# EAGLE design FB_BJ_Taster_1.43_2l (EAGLE 5.04)
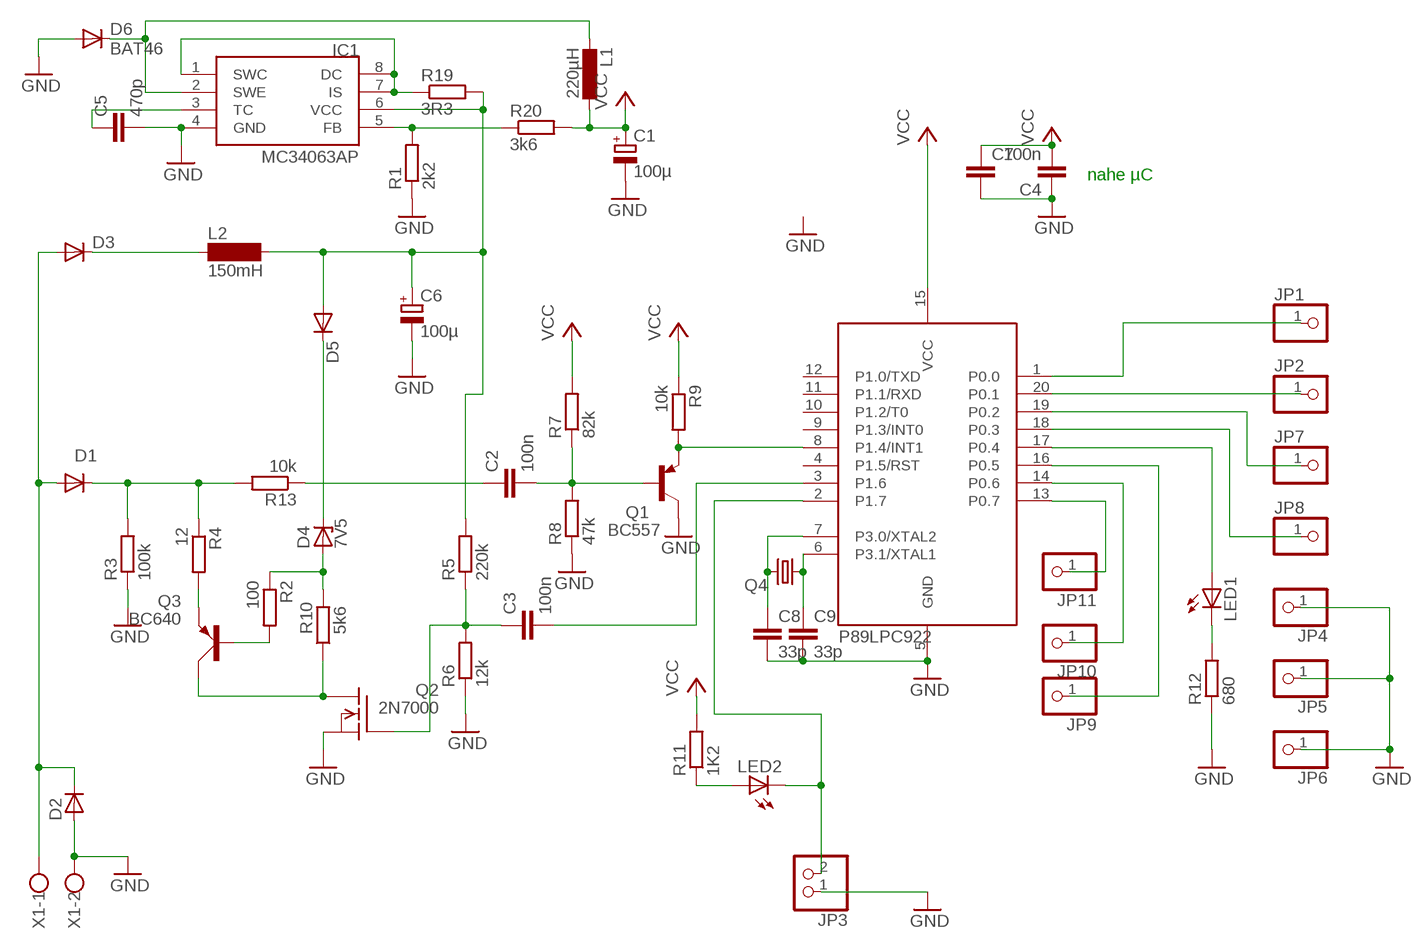
[diagram p0: schematic, sheet 1]

## Parts
C1  100µ  CPOL-EUE5-8.5  [E5-8,5]
C2  100n  C-EU050-024X044  [C050-024X044]
C3  100n  C-EU050-024X044  [C050-024X044]
C4  100n  C-EU050-024X044  [C050-024X044]
C5  470p  C-EU025-024X044  [C025-024X044]
C6  100µ  CPOL-EUE5-8.5  [E5-8,5]
C7  C-EUC1206  [C1206]
C8  33p  C-EUC1206  [C1206]
C9  33p  C-EUC1206  [C1206]
D1  1N4148  [DO35-10]
D2  D-SMB  [SMB]
D3  1N41481N4148S  [D-2.5]
D4  7V5  ZPD  [DO35Z10]
D5  1N4148  [DO35-10]
D6  BAT46  DIODE-D-5  [D-5]
IC1  MC34063AP  [DIL08]
JP1  PINHD-1X1  [1X01]
JP2  PINHD-1X1  [1X01]
JP3  PINHD-1X2  [1X02]
JP4  PINHD-1X1  [1X01]
JP5  PINHD-1X1  [1X01]
JP6  PINHD-1X1  [1X01]
JP7  PINHD-1X1  [1X01]
JP8  PINHD-1X1  [1X01]
JP9  PINHD-1X1  [1X01]
JP10  PINHD-1X1  [1X01]
JP11  PINHD-1X1  [1X01]
L1  220µH  L-EU2200-12.7  [2200-12.7]
L2  150mH  SD12-1000  [SD12_1000]
LED1  LED3MM  [LED3MM]
LED2  LED3MM  [LED3MM]
Q1  BC557  [TO92]
Q2  2N7000  VN2222KM  [TO237]
Q3  BC640  [SOT54D]
Q4  CRYSTALHC49S  [HC49/S]
R1  2k2  R-EU_0207/2V  [0207/2V]
R2  100  R-EU_0207/2V  [0207/2V]
R3  100k  R-EU_0207/2V  [0207/2V]
R4  12  R-EU_0207/2V  [0207/2V]
R5  220k  R-EU_0207/2V  [0207/2V]
R6  12k  R-EU_0207/2V  [0207/2V]
R7  82k  R-EU_0204/7  [0204/7]
R8  47k  R-EU_0204/7  [0204/7]
R9  10k  R-EU_0207/2V  [0207/2V]
R10  5k6  R-EU_0207/2V  [0207/2V]
R11  1K2  R-EU_0207/2V  [0207/2V]
R12  680  R-EU_0204/7  [0204/7]
R13  10k  R-EU_0207/2V  [0207/2V]
R19  3R3  R-EU_0207/2V  [0207/2V]
R20  3k6  R-EU_0207/2V  [0207/2V]
U1  89LPC922  [DIL20]
X1  W237-02P  [W237-132]

## Nets
GND: C1.- C4.1 C5.2 C6.- C7.2 C8.2 C9.2 D2.2(A) D6.A IC1.4(GND) JP3.1 JP4.1 JP5.1 JP6.1 Q1.3(C) Q2.3(S) R1.1 R3.1 R6.1 R8.1 R12.1 U1.5(GND) X1.2
N$1: Q1.1(E) R9.2 U1.8(P1.4/INT1)
N$2: C2.2 Q1.2(B) R7.1 R8.2
N$3: IC1.5(FB) R1.2 R20.1
N$4: IC1.1(SWC) IC1.7(IS) IC1.8(DC) R19.1
N$5: C3.2 U1.3(P1.6)
N$6: Q2.1(D) Q3.C R10.1
N$7: C6.+ D5.A IC1.6(VCC) L2.2 R5.2 R19.2
N$8: D3.C L2.1
N$9: D1.C R3.2 R4.1 R13.2
N$10: D6.C IC1.2(SWE) L1.2
N$11: D4.A R2.1 R10.2
N$12: Q3.E R4.2
N$13: C5.1 IC1.3(TC)
N$14: Q3.B R2.2
N$15: LED1.A U1.17(P0.4)
N$16: D1.A D2.1(C) D3.A X1.1
N$17: JP3.2 LED2.K(C) U1.2(P1.7)
N$18: LED1.K(C) R12.2
N$19: LED2.A R11.1
N$20: JP7.1 U1.19(P0.2)
N$21: JP1.1 U1.1(P0.0)
N$22: JP2.1 U1.20(P0.1)
N$23: JP8.1 U1.18(P0.3)
N$28: JP9.1 U1.16(P0.5)
N$29: JP11.1 U1.13(P0.7)
N$30: JP10.1 U1.14(P0.6)
N$31: C9.1 Q4.1 U1.6(P3.1/XTAL1)
N$32: C8.1 Q4.2 U1.7(P3.0/XTAL2)
N$33: C2.1 R13.1
N$34: C3.1 Q2.2(G) R5.1 R6.2
N$40: D4.C D5.C
VCC: C1.+ C4.2 C7.1 L1.1 R7.2 R9.1 R11.2 R20.2 U1.15(VCC)
Unconnected: U1.4(P1.5/RST) U1.9(P1.3/INT0) U1.10(P1.2/T0) U1.11(P1.1/RXD) U1.12(P1.0/TXD)

## Notes on the sheet
- nahe µC
- P89LPC922

## Library data of the parts
C1 C6 = rcl:CPOL-EU: POLARIZED CAPACITOR, European symbol
C2-C5 C7-C9 = rcl:C-EU: CAPACITOR, European symbol
D1 D3 D5 = diode:1N4148: DIODE high speed (Philips)
D2 = semicon-smd-ipc:D-: DIODE unfilled
D4 = diode:ZPD: Z DIODE 500 mW
D6 = diode:DIODE-: DIODE
IC1 = mc34063:MC34063
JP1 JP2 JP4-JP11 = pinhead:PINHD-1X1: PIN HEADER
JP3 = pinhead:PINHD-1X2: PIN HEADER
L1 = rcl:L-EU: INDUCTOR, European symbol
L2 = inductor-neosid:SD12: INDUCTOR nominal inductance
LED1 LED2 = led:LED: LED OSRAM: - CHIPLED LG R971, LG N971, LY N971, LG Q971, LY Q971, LO R971, LY R971 LH N974, LH R974 LS Q976, LO Q976, LY Q976 LO Q996 - Hyper CHIPLED LW Q18S LB Q993, LB Q99A, LB R99A - SideLED LS A670, LO A670, LY A670, LG A670, LP A670 LB A673, LV A673, LT A673, LW A673 LH A674 LY A675 LS A676, LA A676, LO A676, LY A676, LW A676 LS A679, LY A679, LG A679 - Hyper Micro SIDELED® LS Y876, LA Y876, LO Y876, LY Y876 LT Y87S - SmartLED LW L88C, LW L88S LB L89C, LB L89S, LG L890 LS L89K, LO L89K, LY L89K LS L896, LA L896, LO L896, LY L896 - TOPLED LS T670, LO T670, LY T670, LG T670, LP T670 LSG T670, LSP T670, LSY T670, LOP T670, LYG T670 LG T671, LOG T671, LSG T671 LB T673, LV T673, LT T673, LW T673 LH T674 LS T676, LA T676, LO T676, LY T676, LB T676, LH T676, LSB T676, LW T676 LB T67C, LV T67C, LT T67C, LS T67K, LO T67K, LY T67K, LW E67C LS E67B, LA E67B, LO E67B, LY E67B, LB E67C, LV E67C, LT E67C LW T67C LS T679, LY T679, LG T679 LS T770, LO T770, LY T770, LG T770, LP T770 LB T773, LV T773, LT T773, LW T773 LH T774 LS E675, LA E675, LY E675, LS T675 LS T776, LA T776, LO T776, LY T776, LB T776 LHGB T686 LT T68C, LB T68C - Hyper Mini TOPLED® LB M676 - Mini TOPLED Santana® LG M470 LS M47K, LO M47K, LY M47K Source: http://www.osram.convergy.de - LUMILED® LXK2-PW12-R00, LXK2-PW12-S00, LXK2-PW14-U00, LXK2-PW14-V00 LXK2-PM12-R00, LXK2-PM12-S00, LXK2-PM14-U00 LXK2-PE12-Q00, LXK2-PE12-R00, LXK2-PE12-S00, LXK2-PE14-T00, LXK2-PE14-U00 LXK2-PB12-K00, LXK2-PB12-L00, LXK2-PB12-M00, LXK2-PB14-N00, LXK2-PB14-P00, LXK2-PB14-Q00 LXK2-PR12-L00, LXK2-PR12-M00, LXK2-PR14-Q00, LXK2-PR14-R00 LXK2-PD12-Q00, LXK2-PD12-R00, LXK2-PD12-S00 LXK2-PH12-R00, LXK2-PH12-S00 LXK2-PL12-P00, LXK2-PL12-Q00, LXK2-PL12-R00 Source: www.luxeon.com
Q1 = transistor-pnp:BC557: PNP Transistor
Q2 = transistor-fet:VN2222KM: N-Channel Enhancement MOSFET (VMOS); 60V; 0,5A; 7,5Ohm
Q3 = transistor-small-signal:BC640: PNP TRANSISTOR
Q4 = crystal:CRYSTAL: CRYSTAL
R1-R13 R19 R20 = rcl:R-EU_: RESISTOR, European symbol
U1 = micro-philips:89LPC922
X1 = con-wago-508:W237-02P: WAGO SREW CLAMP

## Board
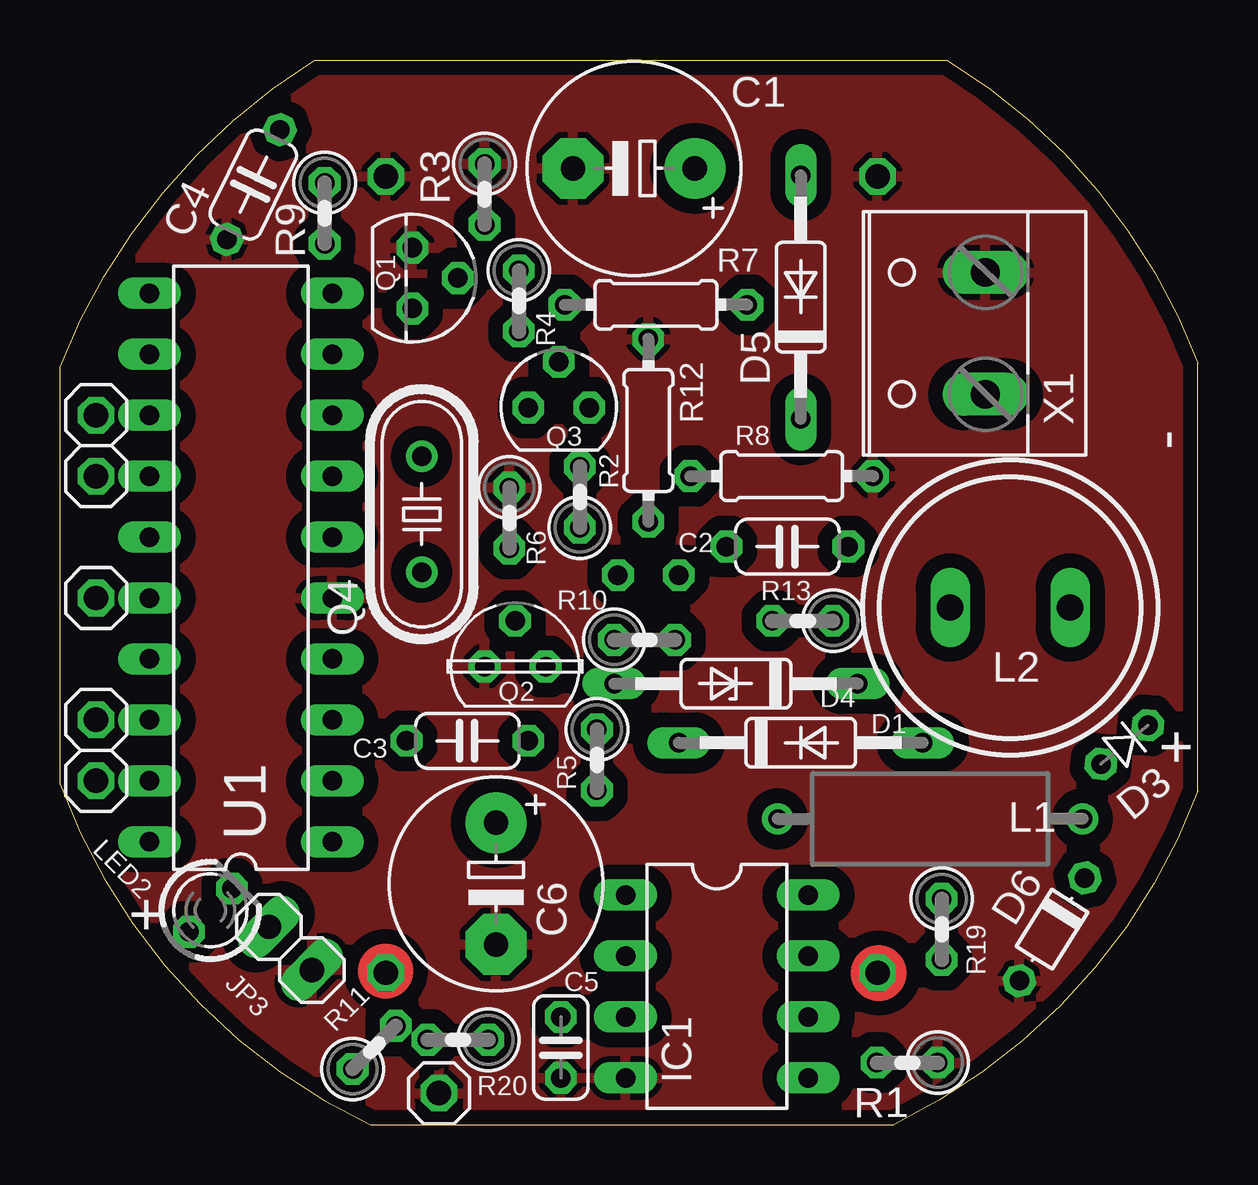
[diagram p1: board, top side]
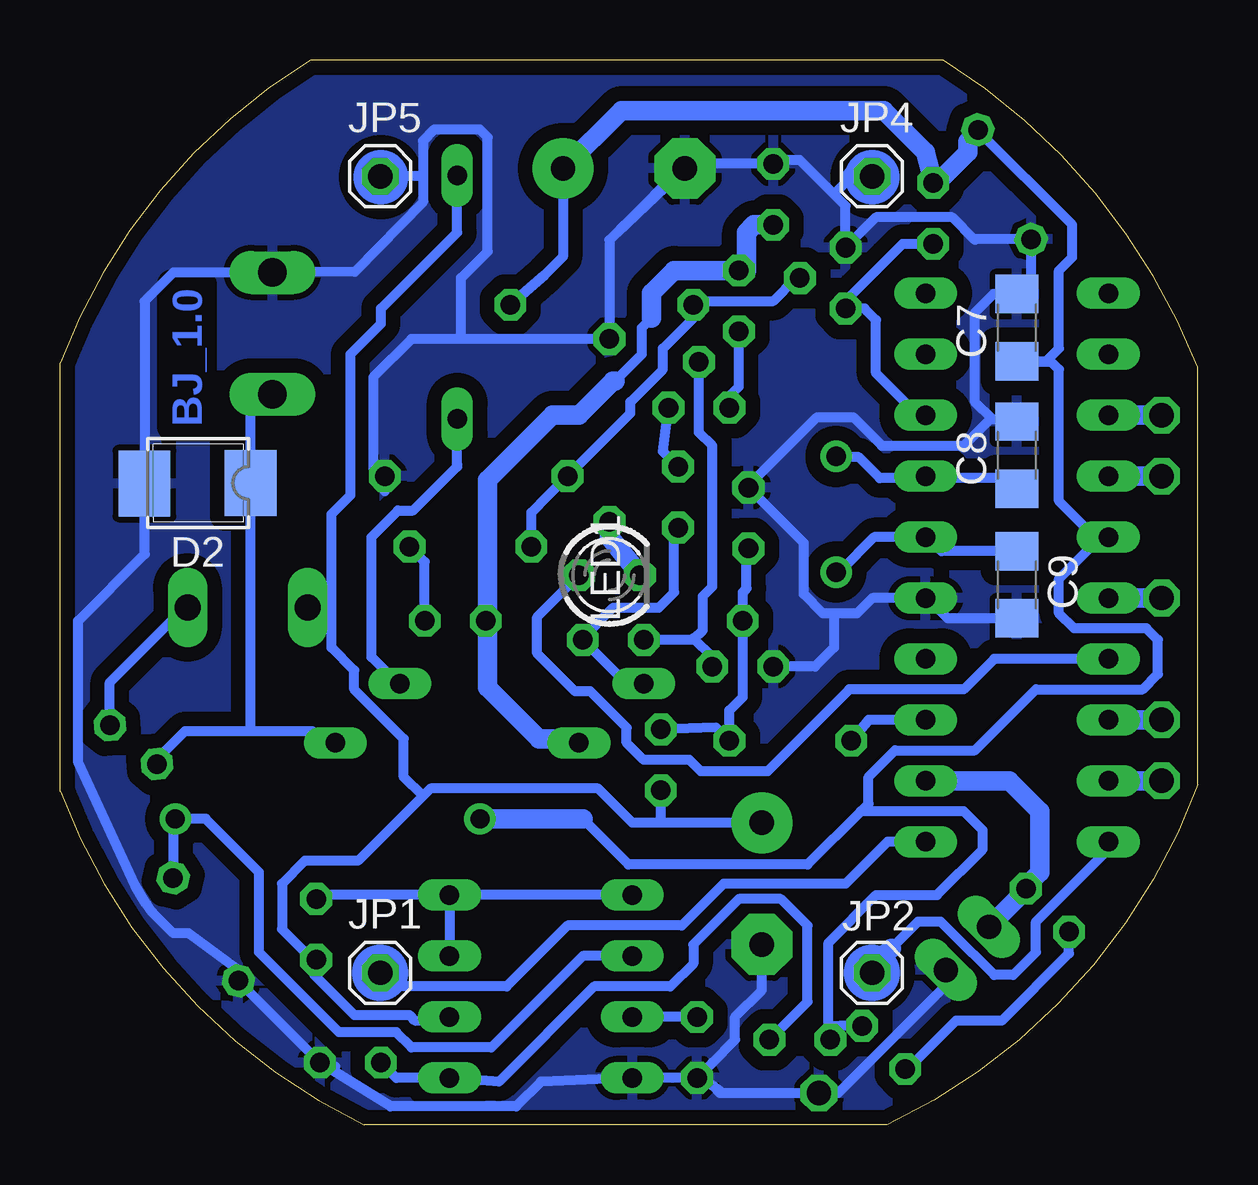
[diagram p2: board, bottom side, seen from below]

Size 47.43 x 44.38 mm. Coordinates in mm from the lower left corner, seen from the top.
Outline: 10.61,44.38 36.97,44.38
Outline: 47.42,13.9 47.43,31.75
Outline: 12.95,0 34.75,0
Outline: 12.95,0 arc-44 0,14.19 0,31.58 arc-36 10.61,44.38
Outline: 36.98,44.38 arc-38 47.43,31.76
Outline: 47.42,13.91 arc-44 34.75,0
Copper layers (1*16): Top 0.035mm / dielectric 1.5mm / Bottom 0.035mm
Design rules "default *": minimum track width 10mil, minimum drill 24mil, track to track 8mil, track to pad 8mil, pad to pad 8mil, via to via 8mil, smd to smd 8mil, copper to edge 20mil, drill to drill 8mil, minimum pad ring 10mil, minimum via ring 8mil, stop-mask expansion 4mil, vias tented up to drill 0mil, thermal gap 10mil

### Footprints (pad centres in the part's own frame; a part is rotated, then mirrored left to right if it is on the bottom)
E5-8,5 = drill 1.016 pad 2.54 round: + -2.54,0 | drill 1.016 pad 2.54 octagon: - 2.54,0
C050-024X044 = drill 0.813 octagon: 1 -2.54,0; 2 2.54,0
C025-024X044 = drill 0.813 octagon: 1 -1.27,0; 2 1.27,0
C1206 = smd 1.6 x 1.8: 1 -1.4,0; 2 1.4,0
DO35-10 = drill 0.813 long: A 5.08,0; C -5.08,0
SMB = smd 2.159 x 2.743: 1 -2.311,-0.127; 2 2.108,-0.102
D-2.5 = drill 0.813 octagon: A 1.27,0; C -1.27,0
DO35Z10 = drill 0.813 long: A 5.08,0; C -5.08,0
D-5 = drill 0.813 octagon: A 2.54,0; C -2.54,0
DIL08 = drill 0.813 long: 1 -3.81,-3.81; 2 -1.27,-3.81; 3 1.27,-3.81; 4 3.81,-3.81; 5 3.81,3.81; 6 1.27,3.81; 7 -1.27,3.81; 8 -3.81,3.81
1X01 = drill 1.016 octagon: 1 0,0
1X02 = drill 1.016 long: 1 -1.27,0; 2 1.27,0
2200-12.7 = drill 0.8 pad 1.27 round: 1 -6.35,0; 2 6.35,0
SD12_1000 = drill 1.1 long: 1 -2.5,0; 2 2.5,0
LED3MM = drill 0.813 octagon: A -1.27,0; K 1.27,0
TO92 = drill 0.813 octagon: 1 1.27,0; 2 0,1.905; 3 -1.27,0
TO237 = drill 0.813 octagon: 1 1.27,0; 2 0,1.905; 3 -1.27,0
SOT54D = drill 0.813 octagon: B 1.27,0; C 0,1.905; E -1.27,0
HC49/S = drill 0.813 round: 1 -2.413,0; 2 2.413,0
0207/2V = drill 0.813 octagon: 1 -1.27,0; 2 1.27,0
0204/7 = drill 0.813 octagon: 1 -3.81,0; 2 3.81,0
DIL20 = drill 0.813 long: 1 -11.43,-3.81; 2 -8.89,-3.81; 3 -6.35,-3.81; 4 -3.81,-3.81; 5 -1.27,-3.81; 6 1.27,-3.81; 7 3.81,-3.81; 8 6.35,-3.81; 9 8.89,-3.81; 10 11.43,-3.81; 11 11.43,3.81; 12 8.89,3.81; 13 6.35,3.81; 14 3.81,3.81; 15 1.27,3.81; 16 -1.27,3.81; 17 -3.81,3.81; 18 -6.35,3.81; 19 -8.89,3.81; 20 -11.43,3.81
W237-132 = drill 1.194 long: 1 -2.54,-0.635; 2 2.54,-0.635

### Placement (x,y rotation side)
C1  23.92,39.86 180 top
C2  30.32,24.1 180 top
C3  16.99,16 180 top
C4  8.06,39.19 64.1 top
C5  20.88,3.22 270 top
C6  18.18,10.05 270 top
C7  7.54,33.23 90 bottom
C8  7.54,27.91 90 bottom
C9  7.54,22.51 270 bottom
D1  30.88,15.92 0 top
D2  41.8,26.62 180 bottom
D3  44.37,15.85 219.5 top
D4  28.18,18.39 180 top
D5  30.88,34.5 90 top
D6  41.35,8.15 237.6 top
IC1  27.38,5.76 270 top
JP1  34.08,6.33 0 bottom
JP2  13.58,6.33 0 bottom
JP3  9.6,7.35 135 top
JP4  13.58,39.53 0 bottom
JP5  34.08,39.53 0 bottom
JP6  15.79,1.32 0 top
JP7  1.51,14.34 0 top
JP8  1.51,16.88 0 top
JP9  1.51,21.96 0 top
JP10  1.51,27.04 0 top
JP11  1.51,29.58 0 top
L1  36.27,12.75 0 top
L2  39.61,21.56 180 top
LED1  24.53,22.91 0 bottom
LED2  6.27,8.94 45 top
Q1  14.68,35.29 270 top
Q2  18.97,19.1 0 top
Q3  20.8,29.89 0 top
Q4  15.08,25.45 90 top
R1  35.32,2.59 180 top
R2  21.67,26.16 90 top
R3  17.7,38.78 270 top
R4  19.13,34.34 270 top
R5  22.38,15.21 270 top
R6  18.73,25.29 270 top
R7  24.84,34.18 0 top
R8  30.08,27.04 180 top
R9  11.03,37.99 270 top
R10  24.37,20.21 0 top
R11  13.1,3.22 45 top
R12  24.53,28.94 270 top
R13  30.96,21 180 top
R19  36.75,8.15 270 top
R20  16.59,3.54 180 top
U1  7.54,23.23 90 top
X1  37.94,32.99 90 top

### Tracks (layer width: path | path; a pad name or v marks a point on that pad's centre or on a via)
GND
  Bottom 0.406: C5.2 IC1.4 27.38,1.8 28.42,0.76 33.66,0.76 R1.1 | C5.2 20.24,2.59 19.29,3.54 19.29,4.5 18.18,5.61 C6.- | R1.1 35.96,2.43 | Q1.3 14.68,38.31 15.16,38.78 | 15.16,38.78 16.59,40.21 17.7,40.21 R3.1 21.35,40.05 24.05,37.36 C1.- 24.21,37.2 24.53,36.88 R12.1 29.13,32.75 29.92,32.75 30.72,32.75 | 30.72,32.75 31.99,32.75 32.78,32.75 34.37,31.16 34.37,27.35 34.05,27.04 R8.1 33.89,26.4 | Q1.3 | Q1.3 13.41,37.83 10.24,37.83 9.29,36.88 9.26,36.91 C4.1 6.95,35.09 7.38,34.66 C7.2 8.52,34.63 9.29,33.86 9.29,30.13 8.57,29.42 | 32.3,39.58 32.3,38.47 35.14,35.56 X1.2 38.23,35.72 38.42,35.53 42.7,35.53 43.91,34.33 D2.2 | 32.3,39.58 32.3,41.01 31.83,41.48 29.92,41.48 29.61,41.17 29.61,36.4 30.72,35.29 30.72,32.75 | 30.72,32.75 | JP5.1 32.35,39.53 32.3,39.58 | 15.16,38.78 14.41,39.53 | 20.24,1.64 19.76,1.32 | JP3.1 10.34,5.98 15,1.32 JP6.1 19.92,1.32 20.24,1.64 | R1.1 36.43,2.43 D6.A 39.99,6.47 42.07,7.99 42.7,7.99 43.58,8.86 | 20.24,1.64 C5.2 | 11.27,21.96 U1.5 | C9.2 10.43,21.11 11.27,21.96 | C8.2 7.38,29.34 7.46,29.42 8.57,29.42 | 8.57,29.42 8.65,29.42 9.76,28.31 13.18,28.31 14.37,29.5 15.87,29.5 17.22,28.15 | 11.27,21.96 13.57,21.96 14.21,21.32 15.16,21.32 | 15.16,21.32 15.64,21.32 16.43,22.12 16.43,24.26 R6.1 | 17.78,25.61 | Q2.3 15.95,19.1 15.16,19.89 15.16,21.32 | R6.1 18.73,26.64 17.22,28.15 | 17.22,28.15 | R6.1 | R6.1 | 43.89,27.75 43.89,23.78 46.67,21 46.67,15.13 44.29,9.97 arc-9 43.58,8.86 | 43.58,8.86 | 15.79,0.84
  Bottom 0.813: 14.41,39.53 JP4.1
  pour Bottom (isolate 0.61): 9.92,45.21 38.34,45.21 48.66,34.9 48.66,11.48 35.8,-1.38 10.79,-1.38 -1.03,10.45 -1.03,35.69 8.49,45.21
  pour Top (isolate 0.61): -0.95,35.69 -0.87,35.69 8.57,45.13 38.58,45.13 48.89,34.82 48.89,11.8 35.8,-1.3 10.87,-1.3 -0.87,10.45
N$1
  Bottom 0.406: Q1.1 | Q1.1 13.89,34.02 13.41,33.55 13.41,31.32 11.67,29.58 U1.8 | Q1.1 14.68,34.34 12.3,36.72 R9.2
N$2
  Bottom 0.406: Q1.2 16.75,35.29 17.7,34.34 21.03,34.34 R7.1 | C2.2 27.78,25.53 27.07,26.24 R8.2 23.65,29.66 23.65,30.13 22.3,31.48 22.3,32.35 21.03,33.62 R7.1 | R7.1
N$3
  Bottom 0.406: 16.27,8.3 17.38,9.42 19.13,9.42 21.03,7.51 21.03,6.72 21.99,5.77 25.16,5.77 29.13,1.8 IC1.5 33.42,1.95 R1.2 | 16.27,8.3 | 16.27,8.3 16.27,5.13 R20.1
N$4
  Bottom 0.406: IC1.8 36.67,9.57 36.67,9.42 R19.1 | IC1.8 IC1.7 | IC1.1 IC1.8
N$5
  Bottom 0.406: C3.2 13.73,16.88 U1.3
N$6
  Bottom 0.406: Q3.C 20.8,28.86 20.24,28.31 20.24,22.43 20.64,22.04 20.64,20.61 20.99,20.25 | 20.99,20.25 21.03,20.21 R10.1 | 20.99,20.25 21.03,20.29 | 20.99,20.25 | Q2.1 20.24,19.5 20.99,20.25
N$7
  Bottom 0.406: IC1.6 32.62,4.34 32.86,4.57 35.16,4.57 36.83,6.24 36.67,6.88 R19.2 36.91,6.88 38.18,8.15 38.18,10.05 37.23,11 35,11 32.3,13.7 | C6.+ 22.38,12.59 | 22.38,12.59 23.57,12.59 25,14.02 31.99,14.02 32.3,13.7 | D5.A 30.88,37.2 34.05,34.02 34.05,33.39 35.32,32.12 35.32,26.24 36.12,25.45 36.12,21.56 | 22.38,12.59 R5.2 | 36.12,21.56 36.12,19.89 35.16,18.94 35.16,18.15 33.1,16.08 33.1,14.5 32.3,13.7 | 36.12,21.56 L2.2
N$8
  Bottom 0.406: L2.1 42.23,21.56 45.35,18.44 D3.C
N$9
  Bottom 0.406: 18.81,35.61 R4.1 | 22.78,33.62 23.18,33.23 23.18,32.12 24.29,31.01
  Bottom 0.813: R3.2 18.49,37.51 18.81,37.2 18.81,35.61 21.83,35.61 22.78,34.66 22.78,33.62 | D1.C 26.35,15.92 26.35,16.08 27.46,16.08 29.61,18.23 29.61,21.08 | 29.61,21.08 R13.2 | 29.61,21.08 29.61,26.88 26.91,29.58 25.8,29.58 24.37,31.01 24.29,31.01
N$10
  Bottom 0.406: IC1.2 25.64,7.04 29.45,3.22 32.78,3.22 33.42,3.86 35.8,3.86 39.13,7.19 39.13,10.53 41.35,12.75 L1.2 42.62,12.59 42.72,12.5 D6.C
N$11
  Bottom 0.406: R10.2 25.72,20.21 24.37,21.56 22.46,21.56 21.83,22.2 21.83,24.66 21.59,24.89 R2.1 | R10.2 | R10.2 23.81,18.38 23.18,18.38 | 23.18,18.38 | D4.A 23.18,18.38
N$12
  Bottom 0.406: Q3.E 19.68,30.21 19.13,30.77 R4.2
N$13
  Bottom 0.406: C5.1 IC1.3
N$14
  Bottom 0.406: R2.2 | R2.2 | Q3.B 22.3,28.07 R2.2
N$15
  Bottom 0.406: U1.17 8.49,19.42 9.76,18.15 14.52,18.15 17.94,14.73 20.72,14.73 21.19,15.21 23.1,15.21 23.81,15.92 23.81,16.56 25.32,18.07 25.95,18.07 27.54,19.65 27.54,21.16 LED1.A
N$16
  Bottom 0.406: D1.A 36.59,16.08 36.91,16.4 39.53,16.4 | D3.A 43.55,15.08 42.23,16.4 39.53,16.4 | X1.1 38.28,30.55 39.49,30.41 D2.1 39.49,16.52 39.53,16.48 39.53,16.4
N$17
  Bottom 0.406: 7.17,9.79 LED2.K 7.17,9.95
  Bottom 0.813: U1.2 7.86,14.34 6.59,13.07 6.59,10.53 7.17,9.95 | 7.17,9.79 JP3.2
N$18
  Bottom 0.813: R12.2 24.53,24.5 LED1.K
N$19
  Bottom 0.406: LED2.A 5.37,7.14 8.18,4.34 10.08,4.34 11.98,2.43 12.04,2.49 R11.1
N$20
  Bottom 0.813: JP7.1 U1.19
N$21
  Bottom 0.406: 33.51,5.86 33.26,5.77 28.81,5.77 26.27,8.3 21.51,8.3 19.76,10.05 14.68,10.05 12.94,11.8 U1.1
  Bottom 0.813: 33.51,5.86 JP1.1
N$22
  Bottom 0.406: 12.78,7.35 11.67,8.46 10.71,8.46 10.24,7.99 | 10.24,7.99 | 10.24,7.99 8.49,6.24 7.7,6.24 6.75,7.19 6.75,8.46 3.73,11.48 U1.20
  Bottom 0.813: JP2.1 13.58,6.55 12.94,7.19 12.78,7.35
N$23
  Bottom 0.406: 3.57,16.88 U1.18 | 3.57,16.88
  Bottom 0.813: JP8.1 3.57,16.88
N$28
  Bottom 0.813: JP9.1 U1.16
N$29
  Bottom 0.406: JP11.1 1.67,29.58
  Bottom 0.813: 1.67,29.58 U1.13
N$30
  Bottom 0.406: U1.14 3.89,27.04
  Bottom 0.813: JP10.1 U1.14
N$31
  Bottom 0.406: C9.1 10.69,23.91 11.27,24.5 U1.6 13.49,24.5 14.92,23.07 Q4.1
N$32
  Bottom 0.406: 11.43,26.96 U1.7 | C8.1 7.51,26.51 7.54,26.48 8.02,26.96 11.43,26.96 | 11.43,26.96 13.25,26.96 14.13,27.83 14.92,27.83 15,27.75 Q4.2
N$33
  Bottom 0.406: C2.1 32.94,24.18 | C2.1 | R13.1 32.23,23.46 C2.1
N$34
  Bottom 0.406: R5.1 20.08,16.56 19.92,16.4 C3.1 19.53,16.08 | 19.53,16.08 | 19.53,16.08 19.53,17.27 18.97,17.83 Q2.2 18.97,22.2 18.81,22.35 18.81,24.18 R6.2
N$40
  Bottom 0.406: D5.C 30.88,27.51 30.88,27.43 32.7,25.61 33.34,25.61 34.45,24.5 34.45,19.5 33.34,18.38 D4.C 33.89,18.94
VCC
  Bottom 0.406: 25.64,12.75 23.73,10.84 16.27,10.84 14.05,13.07 | 14.05,13.07 12.62,13.07 12.14,13.07 9.76,13.07 8.97,12.27 8.97,11.48 10.87,9.57 13.41,9.57 15.4,7.59 15.4,4.1 | R7.2 27.22,35.42 26.46,36.18 C1.+ 26.43,39.86 | 9.58,40.99 C4.2 9.17,41.44 5.24,37.51 5.24,36.16 5.79,35.61 5.79,32.35 6.32,31.83 C7.1 7.33,31.83 7.3,31.8 6.11,31.8 5.79,31.48 5.79,26 4.29,24.5 4.05,24.5 | 11.03,39.1 R9.1 | 14.05,13.07 13.73,13.38 13.73,14.5 12.62,15.61 9.29,15.61 6.75,18.15 2.3,18.15 1.67,18.78 1.67,20.21 2.14,20.69 5.16,20.69 5.79,21.32 5.79,22.75 4.05,24.5 | 15.16,3.38 R20.2 | 15.4,4.1 15.16,3.38 | 15.16,3.38 | R11.2 14.95,4.12 15.4,4.1 | 4.05,24.5 U1.15
  Bottom 0.813: 9.58,40.99 9.58,40.55 11.03,39.1 | R9.1 11.35,40.53 13.1,42.28 24.02,42.28 26.43,39.86 | 25.64,12.75 L1.1
(copper drawn outside any net)
  shapes: Bottom circle x4, Top circle x2

### Text on the board
Bottom: BJ_1.0
tPlace: - | + | +